# EasyEDA Pro project ProPrj_12V—5V降压元件_2025-09-23.epro

# Schematic 原理图
Board Name: 12V-5V降压; Create Date: 2025-09-21; Page Name: P1; Project Name: 12V—5V降压元件; Schematic Name: 原理图; Update Date: 2025-09-21; Company: 嘉立创EDA; Page Size: A4; Version: V1.0
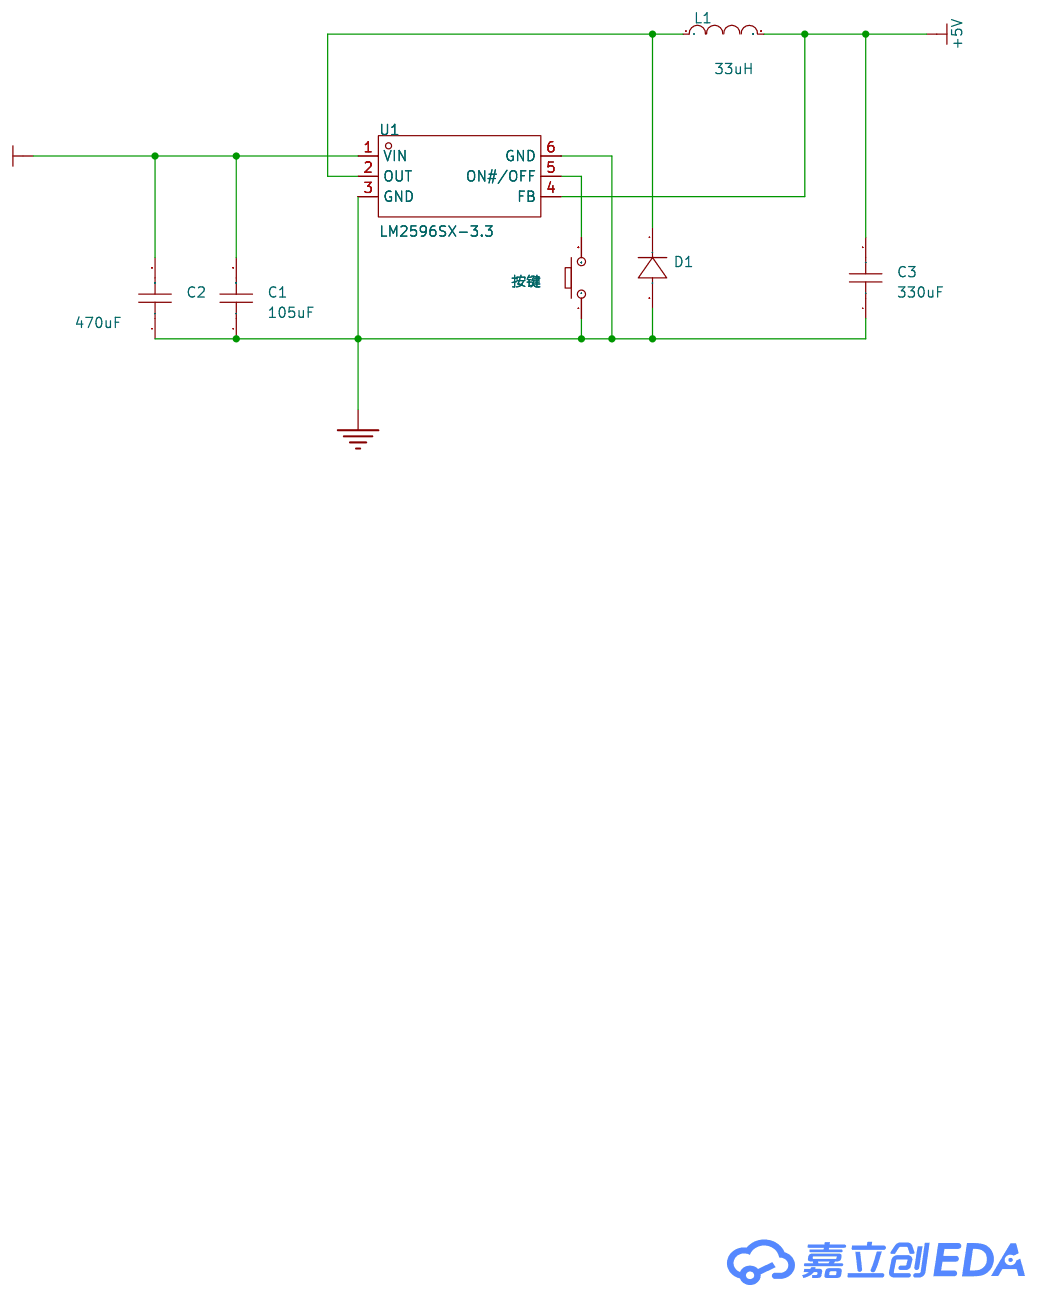
[diagram p0: schematic sheet]

## Parts
C1  105uF  [C0603]
C2  470uF  [C0603]
C3  330uF  [C0603]
D1  -  [DO_1N4007]
L1  33uH  [L0603]
U1  LM2596SX-3.3  [TO-263-5_L10.2-W8.6-P1.70-LS14.4-TL]
按键  -  [Key_TH_3.5x6x4.3]

## Library data of the parts
C1-C3 = CAP_0603: Supplier Footprint: 0603
D1 = D_1N4007A: Supplier Footprint: DO-41
L1 = L_0603
U1 = LM2596SX-3.3: 功能类型:降压型;工作电压:4.5V~40V;输出电压:3.168V~3.432V;输出电流:3A;; LCSC Part Name: 3A 150kHz DC-DC开关稳压电路; Supplier Part: C5186052; Manufacturer: Slkor(萨科微); Supplier Footprint: TO-263-5; JLCPCB Part Class: 扩展库; Datasheet: https://atta.szlcsc.com/upload/public/pdf/source/20221009/64F79A230D311A3FF8E32A0D0A3DF76C.pdf; Supplier: LCSC; Function: 降压型; Input Voltage: 4.5V~40V; Output Voltage: 3.168V~3.432V; Output Current: 3A; Switching Frequency: 150kHz; Operating Temperature: -40℃~+125℃; Number of Outputs: 1; Quiescent Current (Iq): 10mA; Switch tube (built-in/external): 内置
按键 = Key_TH_3.5x6x4.3: Supplier Footprint: 插件

## Nets
+5V: C3.2 L1.2 U1.4(FB)
+12V: C1.2 C2.2 U1.1(VIN)
GND: C1.1 C2.1 C3.1 D1.2(A) U1.3(GND) U1.6(GND) 按键.A
$1N596: D1.1(K) L1.1 U1.2(OUT)
$1N723: U1.5(ON#/OFF) 按键.B

# Board PCB1
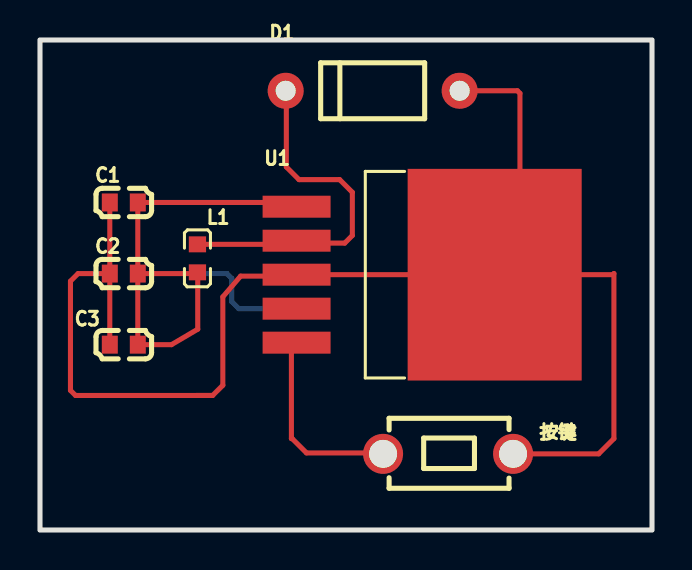
[diagram p1: board, top side]
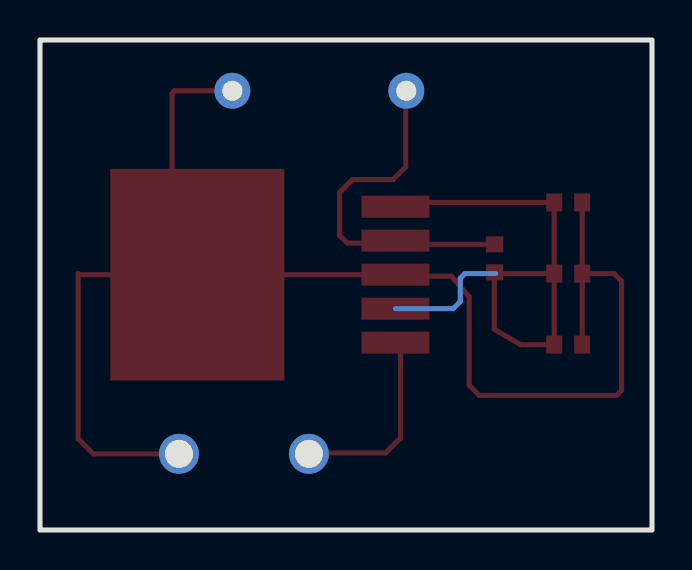
[diagram p2: board, bottom side, seen from below]

Outline 30.61 x 24.51 mm; copper layers: Top Layer, Bottom Layer. Coordinates in mm from the lower left corner of the outline.
Outline path: rectangle 0,24.51 30.61,0
Stack: Top Layer 0.035mm / Dielectric1 1.51mm FR4 er 4.5 / Bottom Layer 0.035mm

## Design rules (mm)
template: JLCPCB Capability(Two Layers Board)
spacing copperThickness1oz (default): track to track 0.102, other pairs 0.152 to 0.3
spacing copperThickness2oz: track to track 0.203, other pairs 0.152 to 0.3
track width copperThickness1oz (default): min 0.127, default 0.254, max 2.54
track width copperThickness2oz: min 0.203, default 0.254, max 2.54
differential pair differentialPair (default): width min 0.127, default 0.254, max 2.54; gap min 0.152, default 0.152
via viaSize (default): diameter min 0.5, default 0.61, max 10; hole min 0.3, default 0.305, max 6.3

## Placement (name value [footprint] x y rotation side)
C1  105uF  [C0603]  4.19 16.38 0 top
C2  470uF  [C0603]  4.19 12.83 0 top
C3  330uF  [C0603]  4.19 9.27 0 top
D1  -  [DO_1N4007]  16.64 21.97 0 top
L1  33uH  [L0603]  7.87 13.59 270 top
U1  LM2596SX-3.3  [TO-263-5_L10.2-W8.6-P1.70-LS14.4-TL]  17.78 12.77 0 top
按键  -  [Key_TH_3.5x6x4.3]  20.57 3.81 180 top

## Footprints (pads in the part's own frame, mm; a bottom-side part is the same pattern mirrored in y, then rotated)
C0603
  rect 0.8x0.9 smd: 1(-0.7,0) 2(0.7,0)
DO_1N4007
  round 1.8 hole 1: 1(-4.35,0) 2(4.35,0)
Key_TH_3.5x6x4.3
  round 1.999 hole 1.399: A(-3.084,0) B(3.416,0)
L0603
  rect 0.8x0.864 smd: 1(-0.7,0) 2(0.7,0)
TO-263-5_L10.2-W8.6-P1.70-LS14.4-TL
  rect 3.4x1.1 smd: 1(-4.953,3.4) 2(-4.953,1.7) 3(-4.953,0) 4(-4.953,-1.7) 5(-4.953,-3.4)
  rect 8.705x10.587 smd: 6(4.953,0)

## Nets
As in the schematic.

## Routing (per net, layer and track width the routed paths; a pad name or vN(x,y) marks a point on that pad's centre or on a via; arc(x,y) is an arc through that point)
+5V: length 6
  Top Layer w0.254: C3.2 6.57,9.27 7.89,10.05 7.89,12.81
+12V: length 18.1
  Top Layer w0.254: C2.2 C1.2 12.62,16.38 U1.1 ; C2.2 4.89,9.27 ; C2.2 7.81,12.83 7.87,12.89
GND: length 73.4
  Top Layer w0.254: 8.59,6.73 1.78,6.73 1.52,6.98 1.52,12.45 1.91,12.83 C2.1 ; C1.1 C2.1 ; C2.1 C3.1 ; 7.83,6.73 8.64,6.73 9.14,7.24 9.14,11.66 10.03,12.7 12,12.7 12.07,12.77 ; U1.3 U1.6 ; U1.6 24,14.04 24,21.84 23.88,21.97 D1.2 ; U1.6 28.65,12.77 28.7,12.83 28.7,4.57 27.94,3.81 按键.A
$1N596: length 17.8
  Top Layer w0.254: L1.1 12.65,14.29 U1.2 12.95,14.35 15.24,14.35 15.62,14.73 15.62,16.89 14.99,17.53 12.95,17.53 12.32,18.16 12.32,21.94 D1.1
$1N723: length 9.9
  Top Layer w0.254: 12.57,9.52 12.57,4.57 12.61,4.57 13.33,3.86 17.11,3.86 按键.B
